# Altium project ISOLATED_CONTROLLER.PrjPcb
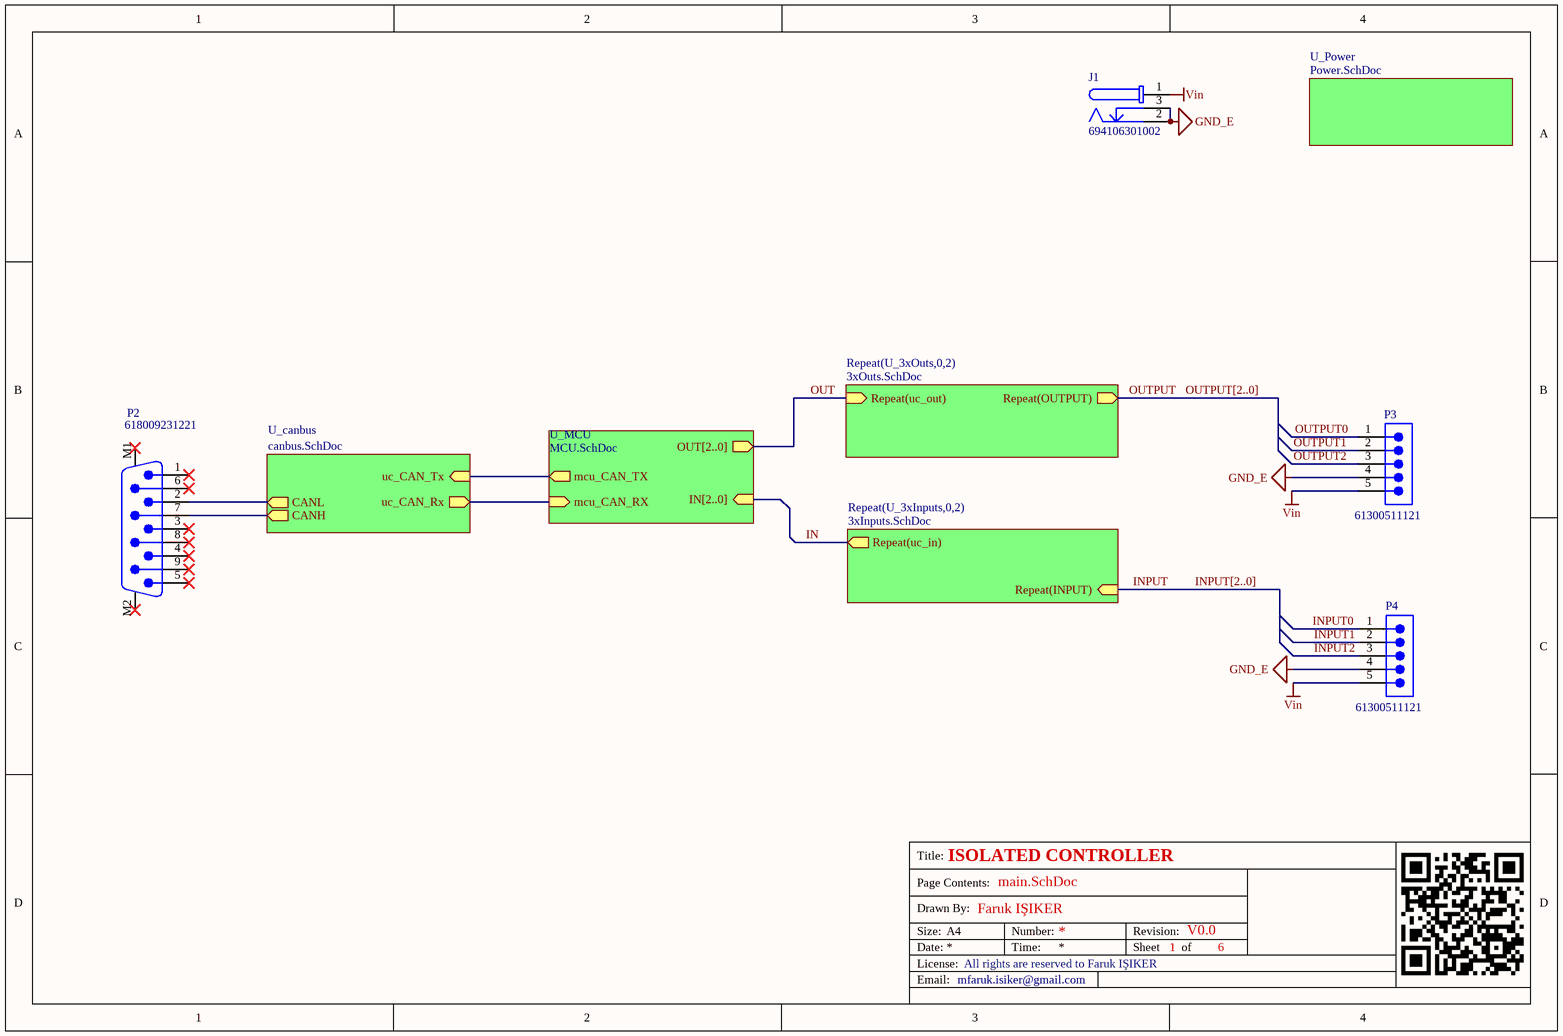
[diagram p0: main.SchDoc]
VersionRevision: V0.0; Project: ISOLATED CONTROLLER; License: All rights are reserved to Faruk IŞIKER; E-Mail: mfaruk.isiker@gmail.com; DrawnBy: Faruk IŞIKER
6 sheets, 88 parts. Net scope: hierarchical (ports join the sheet entries above them; power ports are global).
Board file: PCB1.PcbDoc
Sheets:
  main.SchDoc
    U_MCU = MCU.SchDoc
    U_Power = Power.SchDoc
    U_3xInputs0 = 3xInputs.SchDoc
    U_3xInputs1 = 3xInputs.SchDoc
    U_3xInputs2 = 3xInputs.SchDoc
    U_canbus = canbus.SchDoc
    U_3xOuts0 = 3xOuts.SchDoc
    U_3xOuts1 = 3xOuts.SchDoc
    U_3xOuts2 = 3xOuts.SchDoc

## Sheet main.SchDoc
size A4; SheetNumber: 1; SheetTotal: 6

### Parts
J1  694106301002  [694106301002]
P2  618009231221  [618009231221]
P3  61300511121  [61300511121]
P4  61300511121  [61300511121]

### Sub-sheets
Repeat(U_3xInputs,0,2) = 3xInputs.SchDoc: Repeat(uc_in) (out), Repeat(INPUT) (in)
Repeat(U_3xOuts,0,2) = 3xOuts.SchDoc: Repeat(OUTPUT) (out), Repeat(uc_out) (in)
U_canbus = canbus.SchDoc: uc_CAN_Tx (in), uc_CAN_Rx (out), CANH (out), CANL (out)
U_MCU = MCU.SchDoc: mcu_CAN_TX (out), mcu_CAN_RX (in), OUT[2..0] (out), IN[2..0] (in)
U_Power = Power.SchDoc: no entries

### Nets
GND_E: J1.2 J1.3 P3.4 P4.4
Vin: J1.1 P3.5 P4.5
IN: sheet Repeat(U_3xInputs,0,2)/Repeat(uc_in)
INPUT: sheet Repeat(U_3xInputs,0,2)/Repeat(INPUT)
INPUT0: P4.1  [project net INPUT]
INPUT1: P4.2  [project net INPUT]
INPUT2: P4.3  [project net INPUT]
OUT: sheet Repeat(U_3xOuts,0,2)/Repeat(uc_out)
OUTPUT: sheet Repeat(U_3xOuts,0,2)/Repeat(OUTPUT)
OUTPUT0: P3.1  [project net OUTPUT]
OUTPUT1: P3.2  [project net OUTPUT]
OUTPUT2: P3.3  [project net OUTPUT]
uc_CAN_Rx: sheet U_MCU/mcu_CAN_RX, sheet U_canbus/uc_CAN_Rx
uc_CAN_Tx: sheet U_MCU/mcu_CAN_TX, sheet U_canbus/uc_CAN_Tx
NetD5_1: P2.7 ; sheet U_canbus/CANH
NetD5_2: P2.2 ; sheet U_canbus/CANL

Not connected (* = marked no-connect by the designer): P2 1* 3* 4* 5* 6* 8* 9* M1* M2*

### Buses and harness runs
bus INPUT[2..0]
bus OUTPUT[2..0]

### Notes on the sheet
- Title:
- Drawn By:
- Page Contents:
- Size:
- Date:
- License:
- Email:
- A4
- Number:
- Time:
- Revision:
- Sheet
- of

### Library data of the parts
J1 = CMP-1502-00188-2: NexarPartId: 52676100; Voltage Rating (DC): 20V; Gender: Male; Voltage Rating: 24V; Connector Type: Power; Insulation Resistance: 100MΩ; Current Rating: 5A; Shielding: Unshielded; Number of Contacts: 3; Color: Black; Housing Material: Polyamide; Contact Gender: Female; REACH SVHC: Unknown; Termination: Through Hole; Height: 11mm; RoHS: Compliant; Mount: Through Hole; Flammability Rating: UL94 V-0; Packaging: Bulk; Min Operating Temperature: -40°C; Contact Plating: Tin; Max Operating Temperature: 85°C; Operating Supply Voltage: 24V; Contact Material: Gold, Tin
P2 = CMP-1502-00284-2: NexarPartId: 22865742; Pitch: 2.77mm; Number of Contacts: 9; Operating Supply Voltage: 125V; Insulation Resistance: 5GΩ; Gender: Male; Contact Resistance: 30mΩ; Current Rating: 3A; Mount: Through Hole; Housing Material: Steel; Contact Plating: Gold; Width: 12.5mm; Insulation Material: PBT; RoHS: Compliant; Depth: 18.5mm; Contact Material: Gold; Max Operating Temperature: 105°C; Min Operating Temperature: -55°C; Termination: SMD/SMT; Height: 12.7mm; Voltage Rating: 125V; Length: 30.8mm; Orientation: Right Angle; Number of Rows: 2; Number of Pins: 9; REACH SVHC: Unknown
P3 P4 = CMP-1502-01068-3: NexarPartId: 32855526; Connector Type: Male Pin; Gender: Male; Contact Resistance: 20mΩ; Pitch: 2.54mm; Operating Supply Voltage: 250V; Current Rating: 3A; Number of Contacts: 5; Lead Free: Lead Free; Color: Black; Packaging: Bulk; Lead Pitch: 2.54mm; Contact Material: Copper; Min Operating Temperature: -40°C; Contact Mating Length: 5.9944mm; Voltage Rating: 250V; Number of Pins: 5; Number of Positions: 5; Height: 8.89mm; Orientation: Vertical; REACH SVHC: Unknown; RoHS: Compliant; Contact Plating: Gold; Max Operating Temperature: 105°C; Mount: Through Hole; Number of Rows: 1; Termination: Solder

## Sheet MCU.SchDoc
size A4; SheetNumber: 3; SheetTotal: 6
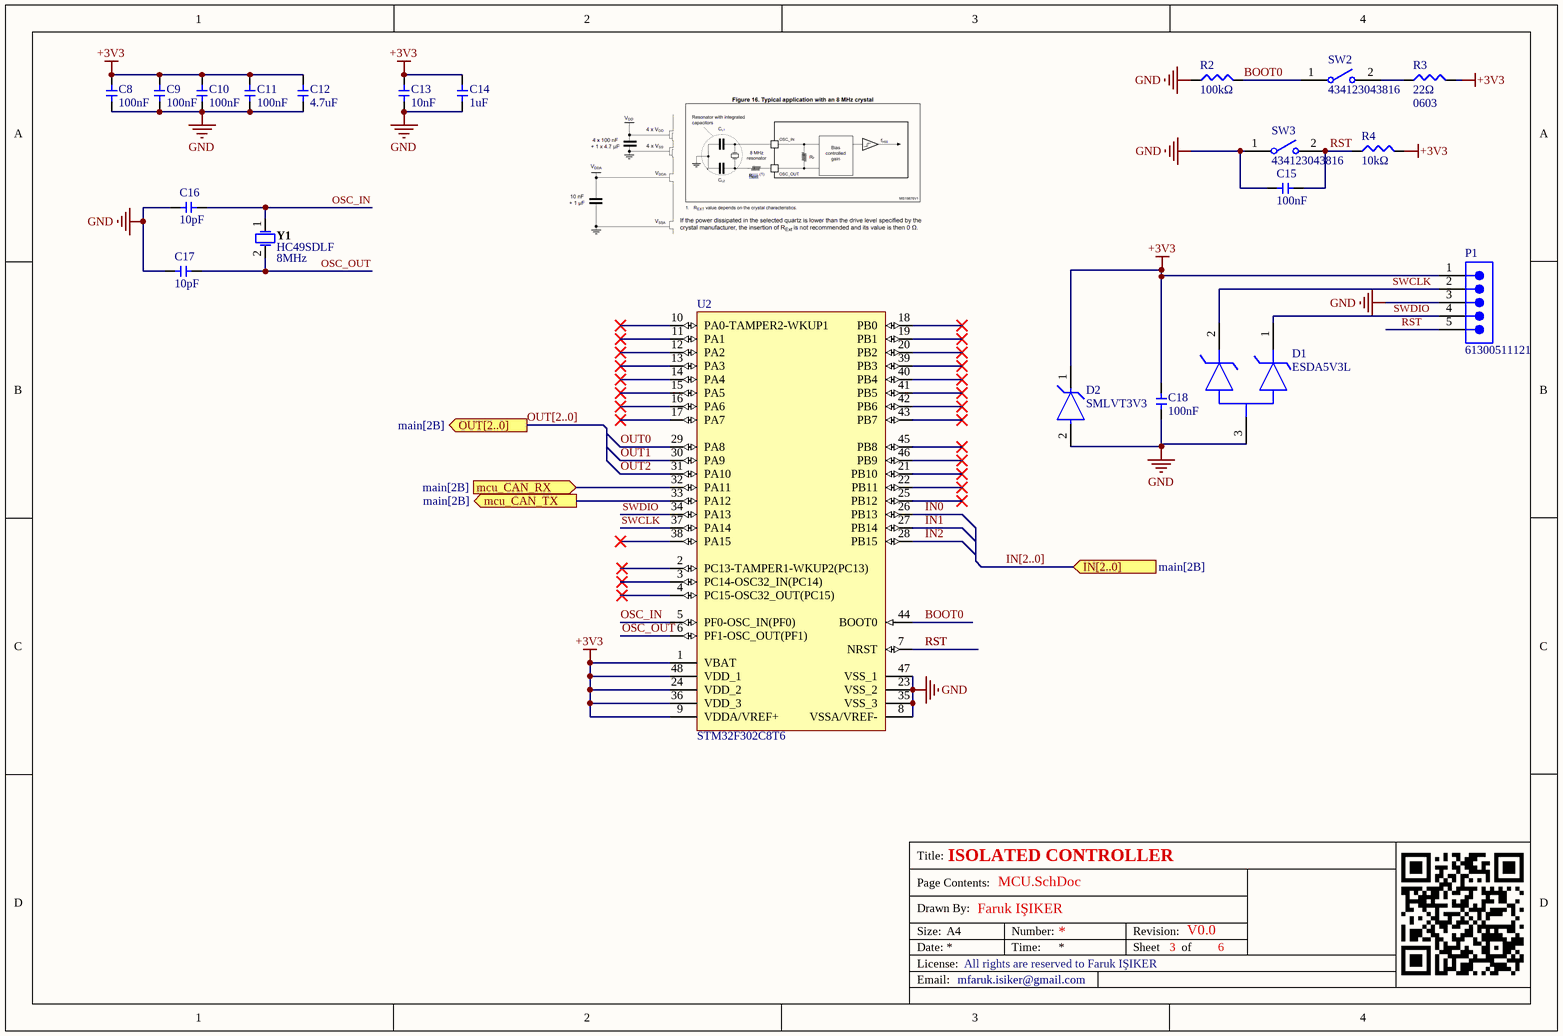
[diagram p1: MCU.SchDoc]

### Parts
C8  value 100nF  [0603_cap]  (hidden comment: 0603_100nF)
C9  value 100nF  [0603_cap]  (hidden comment: 0603_100nF)
C10  value 100nF  [0603_cap]  (hidden comment: 0603_100nF)
C11  value 100nF  [0603_cap]  (hidden comment: 0603_100nF)
C12  value 4.7uF  [0603_cap]  (hidden comment: 0603_4.7uF)
C13  value 10nF  [0603_cap]  (hidden comment: 0603_10nF)
C14  value 1uF  [0603_cap]  (hidden comment: 0603_1uF)
C15  value 100nF  [0603_cap]  (hidden comment: 0603_100nF)
C16  value 10pF  [0603_cap]  (hidden comment: 0603_10pF)
C17  value 10pF  [0603_cap]  (hidden comment: 0603_10pF)
C18  value 100nF  [0603_cap]  (hidden comment: 0603_100nF)
D1  ESDA5V3L  [FP-SOT23-3L-0053390-MFG]
D2  SMLVT3V3  [FP-SMB-MFG]
P1  61300511121  [61300511121]
R2  value 100kΩ  [0603-smd]  (hidden comment: 0603_100K)
R3  value 22Ω  Package: 0603  [0603-smd]  (hidden comment: 0603_22R)
R4  value 10kΩ  [0603-smd]  (hidden comment: 0603_10K)
SW2  434123043816  [WS-TASV_L6W3.5H4.3_4341x30438x6]
SW3  434123043816  [WS-TASV_L6W3.5H4.3_4341x30438x6]
U2  STM32F302C8T6  [STM-LQFP48_L]
Y1  Package Reference: HC49SDLF  Frequency: 8MHz  [FOX-HC49SDLF_V]  (hidden comment: FOXSDLF/080-20)

### Ports
IN[2..0] (in, see main[2B]), mcu_CAN_RX (in, see main[2B]), mcu_CAN_TX (out, see main[2B]), OUT[2..0] (out, see main[2B])

### Nets
+3V3: C8.2 C9.2 C10.2 C11.2 C12.2 C13.2 C14.2 C18.2 D2.1(K) P1.1 R3.2 R4.1 U2.1(VBAT) U2.9(VDDA/VREF+) U2.24(VDD_2) U2.36(VDD_3) U2.48(VDD_1)
GND: C8.1 C9.1 C10.1 C11.1 C12.1 C13.1 C14.1 C15.1 C16.1 C17.1 C18.1 D1.3(COMMON_ANODE) D2.2(A) P1.3 R2.2 SW3.1 U2.8(VSSA/VREF-) U2.23(VSS_2) U2.35(VSS_3) U2.47(VSS_1)
BOOT0: R2.1 SW2.1 U2.44(BOOT0)
IN0: U2.26(PB13)
IN1: U2.27(PB14)
IN2: U2.28(PB15)
OSC_IN: C16.2 U2.5(PF0-OSC_IN(PF0)) Y1.1
OSC_OUT: C17.2 U2.6(PF1-OSC_OUT(PF1)) Y1.2
OUT0: U2.29(PA8)
OUT1: U2.30(PA9)
OUT2: U2.31(PA10)
RST: C15.2 P1.5 R4.2 SW3.2 U2.7(NRST)
SWCLK: D1.2(2_CATHODE) P1.2 U2.37(PA14)
SWDIO: D1.1(1_CATHODE) P1.4 U2.34(PA13)
uc_CAN_Rx: U2.32(PA11) ; port mcu_CAN_RX
uc_CAN_Tx: U2.33(PA12) ; port mcu_CAN_TX
NetR3_1: R3.1 SW2.2

Not connected (* = marked no-connect by the designer): U2 2(PC13-TAMPER1-WKUP2(PC13))* 3(PC14-OSC32_IN(PC14))* 4(PC15-OSC32_OUT(PC15))* 10(PA0-TAMPER2-WKUP1)* 11(PA1)* 12(PA2)* 13(PA3)* 14(PA4)* 15(PA5)* 16(PA6)* 17(PA7)* 18(PB0)* 19(PB1)* 20(PB2)* 21(PB10)* 22(PB11)* 25(PB12)* 38(PA15)* 39(PB3)* 40(PB4)* 41(PB5)* 42(PB6)* 43(PB7)* 45(PB8)* 46(PB9)*

### Buses and harness runs
bus IN[2..0] = port IN[2..0]
bus OUT[2..0] = port OUT[2..0]

### Notes on the sheet
- Title:
- Drawn By:
- Page Contents:
- Size:
- Date:
- License:
- Email:
- A4
- Number:
- Time:
- Revision:
- Sheet
- of

### Library data of the parts
C8-C11 C15 C18 = 0603_100nF: Volt: V; Package: 0603
C12 = 0603_4.7uF: Volt: 25V; Package: 0603
C13 = 0603_10nF: Volt: V; Package: 0603
C14 = 0603_1uF: Volt: V; Package: 0603
C16 C17 = 0603_10pF: Volt: V; Package: 0603
D1 = CMP-12225-000053-1: TVS DIODE 3V SOT23-3; Manufacturer: STMicroelectronics; Capacitance: 220pF; Peak Pulse Power: 300W; Value: 220pF; Max Junction Temp: +150°C; Standoff Height: 0mm; Peak Pulse Current: 25A; Direction: Unidirectional; Number Of Channels: 2; Breakdown Voltage: 5.3V; Mouser Description: ESDA Series 2 Channel 5.3 V 220 pF SMT Uni-Directional Transil? Array - SOT-23; Device Class L2: TVS Diodes; Ipc Land Pattern Name: SOT95P255X115-3; Manufacturer Part Number: ESDA5V3L; Temperature Range Low: -40°C; Device Class L3: unset; Height: 1.4mm; Lead Free: Yes; ComponentLink2URL: https://www.st.com/content/ccc/resource/technical/document/datasheet/eb/9f/a7/ac/7b/b6/46/7f/CD00002057.pdf/files/CD00002057.pdf/jcr:content/translations/en.CD00002057.pdf; Category: Diode; Temperature: -40°C to +150°C; Automotive: No; Package: SOT23-3L-0053390; Digikey Description: TVS DIODE 3V SOT23-3; Reverse Standoff Voltage: 3V; Octopart: https://octopart.com/esda5v3l-stmicroelectronics-347708; Device Class L1: Circuit Protection; Temperature Range High: +150°C; RoHS: TRUE; ComponentLink2Description: Datasheet
D2 = CMP-2000-07127-2: TVS DIODE 3.3V 10.3V SMB; Manufacturer: STMicroelectronics; Standoff Height: 0.05mm; Max Junction Temp: +175°C; Capacitance: 5200pF; Breakdown Voltage: 4.1V; Peak Pulse Power: 600W; Clamping Voltage: 7.3V; Direction: Unidirectional; Number Of Channels: 1; Peak Pulse Current: 50A; Value: 5200pF; ComponentLink2Description: Datasheet; Digikey Description: TVS DIODE 3.3V 10.3V SMB; Automotive: No; Temperature Range Low: -55°C; Device Class L2: TVS Diodes; RoHS: TRUE; ComponentLink2URL: https://www.st.com/resource/en/datasheet/smlvt3v3.pdf; Temperature: -55°C to +175°C; Device Class L3: unset; Package: SMB; Lead Free: Yes; Mouser Description: TVS Diodes - Transient Voltage Suppressors 600W 3.3V Unidirect; Height: 2.65mm; Octopart: https://octopart.com/smlvt3v3-stmicroelectronics-347049; Temperature Range High: +175°C; Category: Diode; Manufacturer Part Number: SMLVT3V3; Device Class L1: Circuit Protection
P1 = CMP-1502-01068-3: as P3 on sheet main; Lead Free: Lead Free; Color: Black; Packaging: Bulk; Lead Pitch: 2.54mm; Contact Material: Copper; Min Operating Temperature: -40°C; Contact Mating Length: 5.9944mm; Voltage Rating: 250V; Number of Pins: 5; Number of Positions: 5; Height: 8.89mm; Orientation: Vertical; REACH SVHC: Unknown; RoHS: Compliant; Contact Plating: Gold; Max Operating Temperature: 105°C; Mount: Through Hole; Number of Rows: 1; Termination: Solder
R2 = 0603_100K: Power: W; Package: 0603
R3 = 0603_22R: Power: W
R4 = 0603_10K: Power: W; Package: 0603
SW2 SW3 = CMP-1460-00005-2: NexarPartId: 22866049; Current Rating: 50mA; Voltage Rating: 12V; Insulation Resistance: 100MΩ; Packaging: Tape and Reel; Min Operating Temperature: -40°C; Contact Current Rating: 50mA; RoHS: Compliant; Height: 4.3mm; Contact Plating: Silver; Color: Black; Width: 6mm; Contact Resistance: 100mΩ; Max Operating Temperature: 85°C
U2 = CMP-0537-00011-1: ARM Cortex-M4 32-bit MCU, 64 KB Flash, 16 KB Internal RAM, 37 I/Os, 48-Pin LQFP, -40 to 85 degC, Tray; Operating Frequency(F) (Processor speed) (MHz): 72; Internal RAM Size (kB): 16; D/A Converter: 1; FLASH Size (Prog) (kB): 64; I/Os (High Current): 37; Supply Voltage(Vcc) min (V): 2; ComponentLink2Description: Datasheet; Package Reference: LQFP48; Package Description: 48-Pin Low Profile Quad Flat Package, Body 7 x 7 mm, Pitch 0.5 mm; Packing: Tray; ComponentLink1URL: http://www.st.com/; ComponentLink1Description: Manufacturer URL; DatasheetVersion: Rev. 5; Core: ARM Cortex-M4; Mounting Technology: Surface Mount; ComponentLink2URL: http://www.st.com/st-web-ui/static/active/en/resource/technical/document/datasheet/DM00093333.pdf
Y1 = CMP-2100-03639-1: Resistance Weld Crystal, 8 MHz, +/- 30 ppm, -20 to 70 degC, 2-Pin SMD, RoHS, Tape and Reel; Manufacturer: FOX Electronics; Series Resistance: 80Ohm; Load Capacitance: 20pF; Tolerance: 50ppm; Frequency Tolerance: 30ppm; Datasheet URL: http://www.foxonline.com/pdfs/hc49sdlf.pdf; Height: 4.5mm; Mount: SurfaceMount; Packaging: TapeandReel; Length: 11.7mm; Termination: SMD/SMT; Number of Pins: 2; Depth: 5mm; Min Operating Temperature: -20degC; Package Quantity: 1000; RoHSCompliant: True; Lead Free: LeadFree; Width: 5mm; Case/Package: SMD/SMT; Manufacturer URL: http://www.foxonline.com/; Max Operating Temperature: 70degC; REACH SVHC: NoSVHC; Datasheet Version: 42064.0; Package Description: 2-Pin Surface Mount Device, Body 5 x 11.7 mm; Frequency Stability: 50ppm; ESR (Equivalent Series Resistance): 80Ohm; Radiation Hardening: No

## Sheet Power.SchDoc
size A4; SheetNumber: 2; SheetTotal: 6
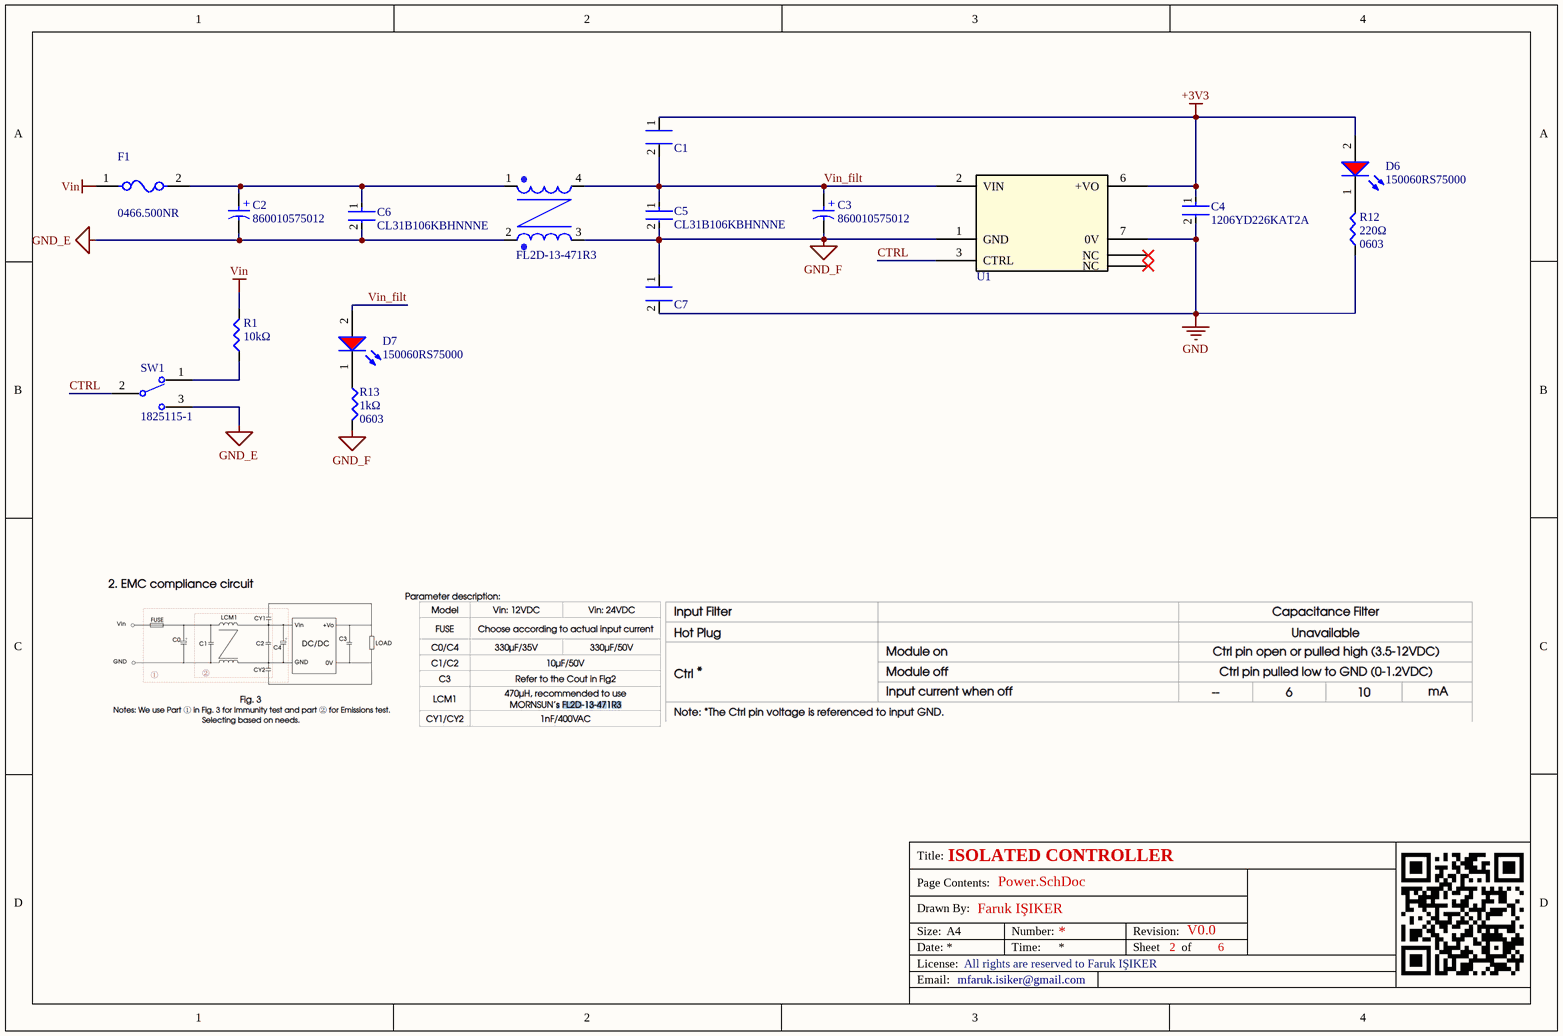
[diagram p2: Power.SchDoc]

### Parts
C1  1nf 400V AC 7.5mm Lead  [PCBComponent_1]  (value not drawn)
C2  860010575012  [WCAP-ATG8_D10H12.5]
C3  860010575012  [WCAP-ATG8_D10H12.5]
C4  1206YD226KAT2A  [FP-1206-L_3_2_0_2-W_1_6_0-IPC_A]
C5  CL31B106KBHNNNE  [FP-CL31B106KBHNNNE-IPC_A]
C6  CL31B106KBHNNNE  [FP-CL31B106KBHNNNE-IPC_A]
C7  1nf 400V AC 7.5mm Lead  [PCBComponent_1]  (value not drawn)
D6  150060RS75000  [WL-SMCW_0603_150060xx75000]
D7  150060RS75000  [WL-SMCW_0603_150060xx75000]
F1  0466.500NR  [FP-0466-MFG]
FL2D-13-471R3  EMC Filte  [FL2D-13-471R3]  (value not drawn)
R1  value 10kΩ  [0603-smd]  (hidden comment: 0603_10K)
R12  value 220Ω  Package: 0603  [0603-smd]  (hidden comment: 0603_220R)
R13  value 1kΩ  Package: 0603  [0603-smd]  (hidden comment: 0603_1K)
SW1  1825115-1  [FP-1825115-1-MFG]
U1  DC DC CONVERTER 3.3V 6W  [VRB_S-6WR3_MNS]  (value not drawn)

### Nets
+3V3: C1.1 C4.1 D6.2(A) U1.6(+VO)
GND: C4.2 C7.2 R12.1 U1.7(0V)
GND_E: C2.2(N) C6.2 FL2D-13-471R3.2 SW1.3
GND_F: C3.2(N) C5.2 C7.1 FL2D-13-471R3.3 R13.2 U1.1(GND)
Vin: F1.1 R1.2
CTRL: SW1.2 U1.3(CTRL)
Vin_filt: C1.2 C3.1(P) C5.1 D7.2(A) FL2D-13-471R3.4 U1.2(VIN)
NetC2_1: C2.1(P) C6.1 F1.2 FL2D-13-471R3.1
NetD6_1: D6.1(K) R12.2
NetD7_1: D7.1(K) R13.1
NetR1_1: R1.1 SW1.1

Not connected (* = marked no-connect by the designer): U1 5(NC)* 8(NC)*

### Notes on the sheet
- Title:
- Drawn By:
- Page Contents:
- Size:
- Date:
- License:
- Email:
- A4
- Number:
- Time:
- Revision:
- Sheet
- of
- (in symbol CMP-03913-54007241-1) +

### Library data of the parts
C1 C7 = C717U102MYVDBA7317: Suppression Cap, 1000Pf, Class X1/ Y2 Rohs Compliant: Yes |Kemet C717U102MYVDBA7317; Manufacturer: KEMET; Supplier 1: Mouser; Manufacturer Part Number: C717U102MYVDBA7317; RoHS: Yes; Category: Ceramic Capacitors; Stock 1: 1838; Pricing 1: 1=0,72, 10=0,387, 50=0,387, 100=0,25, 1000=0,223, 10000=0,18 (USD); RoHS Compliant: Yes; Supplier Part Number 1: 80-C717U102MYVDB7317; ComponentLink1Description: Datasheet; ComponentLink1URL: https://content.kemet.com/datasheets/KEM_C1103_KJY.pdf
C2 C3 = CMP-03913-54007241-1: 860010575012 WCAP-ATG8 Aluminum Electrolytic Capacitors; Ripple Current: 528mA; Voltage Rating: 35V; Capacitance: 330µF; Pitch: 5mm; Tolerance: 20%; Leakage Current: 115.5µA; Life (Hours): 2000hours; Case/Package: Radial; Max Operating Temperature: 85°C; REACH SVHC: Unknown; Min Operating Temperature: -40°C; NexarPartId: 54007241; Lead Pitch: 5mm; RoHS: Non-Compliant; Voltage Rating (DC): 35V; Diameter: 10mm; Height: 12.5mm; Length: 12.5mm
C4 = CMP-1037-04992-2: General Purpose Ceramic Capacitor, 1206, 22uF, 10%, X5R, 15%, 16V; REACH SVHC: No SVHC; Height: 0.07mm; Lead Free: Lead Free; Voltage Rating: 16V; Width: 0.063inch; Voltage Rating (DC): 16V; Mount: Surface Mount; Capacitance: 22uF; Case Code (Imperial): 1206; Package Quantity: 1; Radiation Hardening: No; Packaging: Tape and Reel; Number of Pins: 2; Construction: Flat; Max Operating Temperature: 85°C; Depth: 1.6mm; Case Code (Metric): 3216; Thickness: 0.07inch; Min Operating Temperature: -55°C; Contact Plating: Tin; Dielectric: X5R; Case/Package: 1206; Series: -; Termination: SMD/SMT; Length: 3.2mm; RoHS Compliant: Yes; Tolerance: 10%
C5 C6 = CMP-2000-07530-2: CAP CER 10UF 50V X7R 1206; Manufacturer: Samsung; Tolerance: 10%; Material: Ceramic; Temperature Coefficient: 15%; Temperature Characteristic: X7R; Digikey Description: CAP CER 10UF 50V X7R 1206; Device Class L1: Passive Components; Value: 10uF; Lead Free: Yes; Device Class L3: Ceramic Capacitors; Octopart: https://octopart.com/cl31b106kbhnnne-samsung-30507377; ComponentLink2URL: http://www.samsungsem.com/global/front/downloadcms.do?path=%2F%2Fglobal%2F%2Fsupport%2F%2Fproduct-search%2F%2Fmlcc%2F%2F__icsFiles%2F%2Fafieldfile%2F%2F2019%2F%2F06%2F%2F18&fileName=CL31B106KBHNNNE-19.pdf; Voltage Rating: 50V; Temperature Range Low: -55°C; RoHS: TRUE; Temperature: -55°C to +125°C; Category: Cap; ComponentLink2Description: Datasheet; Manufacturer Part Number: CL31B106KBHNNNE; Automotive: No; Device Class L2: Capacitors; Capacitance: 10uF; Height: 1.8mm; Temperature Range High: +125°C; Package: CL31B106KBHNNNE
D6 D7 = CMP-1426-00001-3: NexarPartId: 29717776; Color: Red; Power Dissipation: 72mW; Max Reverse Voltage (DC): 5V; Peak Wavelength: 630nm; Viewing Angle: 140°; Forward Voltage: 2V; Luminous Intensity: 250mcd; Forward Current: 100mA; Dominant Wavelength: 625nm; Lens Style: Clear, Rectangular; Max Junction Temperature (Tj): 95°C; Test Current: 20mA; Mount: Surface Mount; Packaging: Tape and Reel; Case Code (Metric): 1608; Max Operating Temperature: 85°C; Case Code (Imperial): 0603; REACH SVHC: Unknown; Width: 800µm; Length: 1.6mm; Reverse Voltage: 5V; Height: 700µm; Case/Package: 0603; RoHS: Compliant; Wavelength: 625nm; Min Operating Temperature: -40°C
F1 = CMP-08605-000018-1: FUSE BOARD MOUNT 500MA 63VAC/VDC; Manufacturer: Littelfuse Inc; Fuse Voltage Drop: 158.47mV; Voltage Rating: 63V; Fuse Interrupt Dc Current: 50A; Fuse Blow Speed: Fast; Fuse I2T: 0.006A2Sec; Resistance: 0.248Ω; Value: 0.248Ω; Fuse Current: 0.5A; Manufacturer Part Number: 0466.500NR; Digikey Description: FUSE BOARD MOUNT 500MA 63VAC/VDC; Device Class L2: Fuses; Max Fuse Dc Voltage: 63V; Mouser Description: SMD Fuse 0.5 A Fast-Blow, 466 1206; Octopart: https://octopart.com/0466.500nr-littelfuse-566004; Temperature Range High: +90°C; Lead Free: Yes; Fuse Interrupt Ac Current: 50A; RoHS: TRUE; Device Class L1: Circuit Protection; Height: 0.66mm; Automotive: No; Category: Fuse; Temperature: -55°C to +90°C; Package: 0466; Device Class L3: unset; ComponentLink2URL: https://www.littelfuse.com/~/media/electronics/datasheets/fuses/littelfuse_fuse_466_datasheet.pdf.pdf; Max Fuse Ac Voltage: 63V; ComponentLink2Description: Datasheet; Temperature Range Low: -55°C
FL2D-13-471R3 = FL2D-13-471R3: ComponentLink1Description: Datasheet; ComponentLink1URL: https://www.mornsun-power.com/html/pdf/FL2D-13-471R3.html
R1 = 0603_10K: Power: W; Package: 0603
R12 = 0603_220R: Power: W
R13 = 0603_1K: Power: W
SW1 = CMP-03405-000003-1: SWITCH SLIDE SPDT 250MA 125V; Manufacturer: TE Connectivity; Operating Force: 250gf; Electromechanical Life: 6000Cycles; Contact Resistance: 30mΩ; Voltage Rating Dc: 12V; Temperature Range High: +85°C; Manufacturer Part Number: 1825115-1; Temperature: -10°C to +85°C; Package: 1825115-1; Voltage Rating Ac: 125V; Category: Switch; Digikey Description: SWITCH SLIDE SPDT 250MA 125V; Throw Configuration: SPDT; RoHS: TRUE; Mount: Through Hole; Device Class L2: Switches; ComponentLink2Description: Datasheet; Automotive: No; ComponentLink2URL: https://www.te.com/usa-en/product-1825115-1.html?te_bu=Cor&te_type=other&te_campaign=oct_glo_cor-oct-global-oth-prtnr-fy19-oct-octo-buy-bom_sma-298_2&elqCampaignId=35216; Contact Current Rating: 250mA; Temperature Range Low: -10°C; Device Class L3: Slide Switches; Device Class L1: Electromechanical; Octopart: https://octopart.com/sls121pc04-te+connectivity-39426454; Lead Free: Yes
U1 = VRB1203S-6WR3: Isolated Module DC DC Converter 1 Output 3.3V 1.35A 9V - 18V Input; Mfr_Name: MORNSUN; Type: DC DC Converters; RefDes: RefDes; ComponentLink1Description: Datasheet; ComponentLink1URL: https://www.mornsun-power.com/html/pdf/VRB1203S-6WR3.html

## Sheet 3xInputs.SchDoc
size A4; SheetNumber: 4; SheetTotal: 6
Used 3 times, as channels U_3xInputs0, U_3xInputs1, U_3xInputs2. Parts and nets are listed once, with the designators drawn on the sheet.
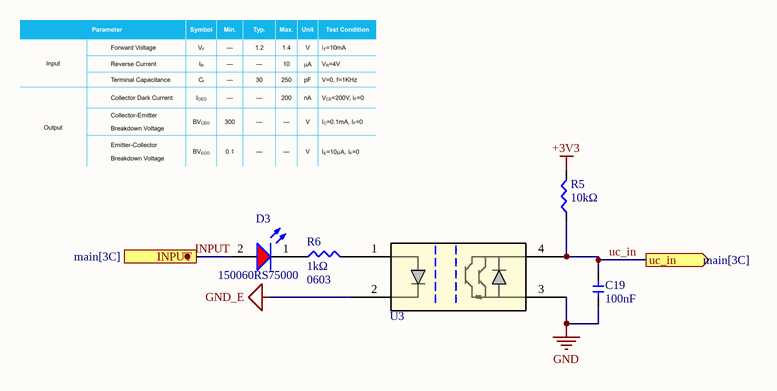
[diagram p3: 3xInputs.SchDoc]

### Parts
C19  value 100nF  [0603_cap]  (hidden comment: 0603_100nF)
D3  150060RS75000  [WL-SMCW_0603_150060xx75000]
R5  value 10kΩ  [0603-smd]  (hidden comment: 0603_10K)
R6  value 1kΩ  Package: 0603  [0603-smd]  (hidden comment: 0603_1K)
U3  LTV-352T  [IC4_LTV-352T_LTO-M]  (value not drawn)

### Ports
INPUT (in, see main[3C]), uc_in (out, see main[3C])

### Nets
+3V3: R5.2
GND: C19.1 U3.3
GND_E: U3.2
INPUT: D3.2(A) ; port INPUT
uc_in: C19.2 R5.1 U3.4 ; port uc_in
NetD3_1: D3.1(K) R6.1
NetR6_2: R6.2 U3.1

### Channels
U_3xInputs0: designators end in A; ports INPUT=INPUT uc_in=IN0
U_3xInputs1: designators end in B; ports INPUT=INPUT uc_in=IN1
U_3xInputs2: designators end in C; ports INPUT=INPUT uc_in=IN2

### Notes on the sheet
- Title:
- Drawn By:
- Page Contents:
- Size:
- Date:
- License:
- Email:
- A4
- Number:
- Time:
- Revision:
- Sheet
- of

### Library data of the parts
C19 = 0603_100nF: Volt: V; Package: 0603
D3 = CMP-1426-00001-3: as D6 on sheet Power; Mount: Surface Mount; Packaging: Tape and Reel; Case Code (Metric): 1608; Max Operating Temperature: 85°C; Case Code (Imperial): 0603; REACH SVHC: Unknown; Width: 800µm; Length: 1.6mm; Reverse Voltage: 5V; Height: 700µm; Case/Package: 0603; RoHS: Compliant; Wavelength: 625nm; Min Operating Temperature: -40°C
R5 = 0603_10K: Power: W; Package: 0603
R6 = 0603_1K: Power: W
U3 = LTV-352T: LTV Series Single Channel 300V 3750 Vrms Transistor Output Optocoupler SMT DIP-4; Mfr_Name: LITE-ON; Manufacturer: Vishay Lite-On; RefDes: RefDes; Type: Type; Supplier 1: Rs; Manufacturer Part Number: LTV-352T; RoHS: Yes; Category: Optocouplers; Stock 1: 22730; Pricing 1: 25=0,29, 50=0,278, 250=0,228, 500=0,2 (GBP); ComponentLink1URL: https://datasheet.ciiva.com/11772/0900766b80de6aef-11772096.pdf?src-supplier=Rs; ComponentLink1Description: https://datasheet.ciiva.com/11772/0900766b80de6aef-11772096.pdf?src-supplier=Rs; ComponentLink2URL: https://datasheet.ciiva.com/2086/ltv-352t-2086258.pdf?src-supplier=Digikey; ComponentLink2Description: https://datasheet.ciiva.com/2086/ltv-352t-2086258.pdf?src-supplier=Digikey; ComponentLink3URL: https://datasheet.ciiva.com/19471/1260710-19471302.pdf?src-supplier=Jameco; ComponentLink3Description: https://datasheet.ciiva.com/19471/1260710-19471302.pdf?src-supplier=Jameco; ComponentLink4URL: https://datasheet.ciiva.com/15118/getdatasheetpartid-145582-15118811.pdf?src-supplier=Verical; ComponentLink4Description: https://datasheet.ciiva.com/15118/getdatasheetpartid-145582-15118811.pdf?src-supplier=Verical; ComponentLink5URL: https://datasheet.ciiva.com/2086/s-110-ltv-352t20140520-2086259.pdf?src-supplier=Digikey; ComponentLink5Description: https://datasheet.ciiva.com/2086/s-110-ltv-352t20140520-2086259.pdf?src-supplier=Digikey; ComponentLink6URL: https://datasheet.ciiva.com/2086/s-110-ltv-352t20140520-2086260.pdf?src-supplier=Digikey; ComponentLink6Description: https://datasheet.ciiva.com/2086/s-110-ltv-352t20140520-2086260.pdf?src-supplier=Digikey; Supplier Part Number 1: 6912063P

## Sheet canbus.SchDoc
size A4; SheetNumber: 6; SheetTotal: 6
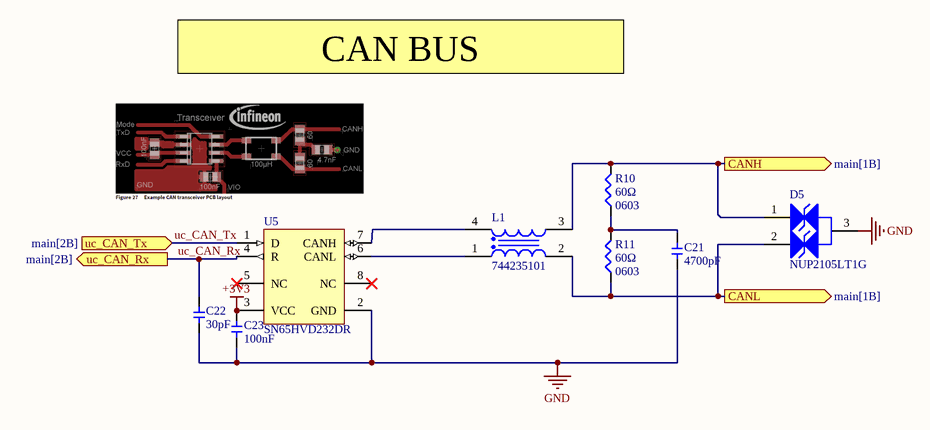
[diagram p4: canbus.SchDoc]

### Parts
C21  value 4700pF  [0603_cap]  (hidden comment: 0603_4700pF)
C22  value 30pF  [0603_cap]  (hidden comment: 0603_30pF)
C23  value 100nF  [0603_cap]  (hidden comment: 0603_100nF)
D5  NUP2105LT1G  [ONSC-SOT-23-3-318-08_V]
L1  744235101  [WE-CNSW_1812]
R10  value 60Ω  Package: 0603  [0603-smd]  (hidden comment: 0603_60R)
R11  value 60Ω  Package: 0603  [0603-smd]  (hidden comment: 0603_60R)
U5  SN65HVD232DR  [D0008A_M]

### Ports
CANH (out, see main[1B]), CANL (out, see main[1B]), uc_CAN_Rx (out, see main[2B]), uc_CAN_Tx (in, see main[2B])

### Nets
+3V3: C23.2 U5.3(VCC)
GND: C21.1 C22.1 C23.1 D5.3(K) U5.2(GND)
uc_CAN_Rx: C22.2 U5.4(R) ; port uc_CAN_Rx
uc_CAN_Tx: U5.1(D) ; port uc_CAN_Tx
NetC21_2: C21.2 R10.1 R11.2
NetD5_1: D5.1(K) L1.3 R10.2 ; port CANH
NetD5_2: D5.2(K) L1.2 R11.1 ; port CANL
NetL1_1: L1.1 U5.6(CANL)
NetL1_4: L1.4 U5.7(CANH)

Not connected (* = marked no-connect by the designer): U5 5(NC)* 8(NC)*

### Notes on the sheet
- CAN BUS
- Title:
- Drawn By:
- Page Contents:
- Size:
- Date:
- License:
- Email:
- A4
- Number:
- Time:
- Revision:
- Sheet
- of

### Library data of the parts
C21 = 0603_4700pF: Volt: V; Package: 0603
C22 = 0603_30pF: Volt: V; Package: 0603
C23 = 0603_100nF: Volt: V; Package: 0603
D5 = CMP-1063-00164-1: Dual Line CAN Bus Protector, 3-Pin SOT-23, Pb-Free, Tape and Reel; Manufacturer: On Semiconductor; IR Max (uA): 0.1; Number of Lines: 2; Direction: Bidirectional; C Max (pF): 30; PPK Max (W): 350; V(BR) Min (V): 26.2; ComponentLink3URL: http://www.onsemi.cn/pub_link/Collateral/318-08.PDF; Mounting Technology: Surface Mount; ComponentLink2Description: Datasheet; PartNumber: NUP2105LT1G; ComponentLink1URL: http://www.onsemi.com/; PackageVersion: Rev. AP, 11/2009; DatasheetVersion: Rev. 5; RoHS: Pb-Free; PackageReference: SOT-23-3-318-08; ComponentLink2URL: http://www.onsemi.cn/pub_link/Collateral/NUP2105L-D.PDF; ComponentLink1Description: Manufacturer URL; PackageDescription: 3-Pin Small Outline Transistor, Body 2.92 x 1.3 mm, Pitch 0.95 mm; Packing: Tape and Reel; ComponentLink3Description: Package Specification
L1 = CMP-207849-000010-2: CMC 100UH 150MA 2LN 8 KOHM SMD; NexarPartId: 61645269; Inductance: 100µH; Number of Lines: 2; DC Resistance (DCR): 2Ω; Voltage Rating (DC): 60V; Test Frequency: 100kHz; Max Current Rating: 150mA; RoHS: Compliant; Packaging: Tape & Reel (TR); Ambient Temperature Range Low: -40°C; Number of Pins: 4; Ambient Temperature Range High: 85°C; Min Operating Temperature: -40°C; Height: 2.8mm; RMS Current (Irms): 150mA; Width: 3.2mm; Current Rating: 150mA; Mount: Surface Mount; Max Operating Temperature: 125°C; Composition: Wirewound; Length: 4.5mm; Series Resistance: 2Ω; Voltage Rating: 60V
R10 R11 = 0603_60R: Power: W
U5 = CMP-0315-00075-2: 3.3 V Can Transceiver, 17 mA, -40 to 85 degC, 8-pin SOIC (D), Green (RoHS & no Sb/Br); Manufacturer: Texas Instruments; Supply Voltage(s)(V): 3.3; Receivers Per Package: 1; ICC(Max)(mA): 17; Rating: Catalog; Transient Pulse Protection(V): -25 to 25; Mounting Technology: Surface Mount; PartNumber: SN65HVD232DR; Code_JEDEC: MS-012AA; Eco-Plan: Green (RoHS & no Sb/Br); Isolated: No; SubFamily: CAN; Footprint: SN65HVD232; Drivers Per Package: 1; ComponentLink1URL: http://www.ti.com/general/docs/lit/getliterature.tsp?genericPartNumber=SN65HVD232&fileType=pdf; ComponentLink1Description: Datasheet; PackageDescription: 8-Pin Plastic Small Outline Integrated Circuit, 4.9 x 3.9 mm, Pitch 1.27 mm Pitch; PackageReference: D0008A; DatasheetVersion: SLOS346K; PackageVersion: revM, Jun-2011

## Sheet 3xOuts.SchDoc
size A4; SheetNumber: 5; SheetTotal: 6
Used 3 times, as channels U_3xOuts0, U_3xOuts1, U_3xOuts2. Parts and nets are listed once, with the designators drawn on the sheet.
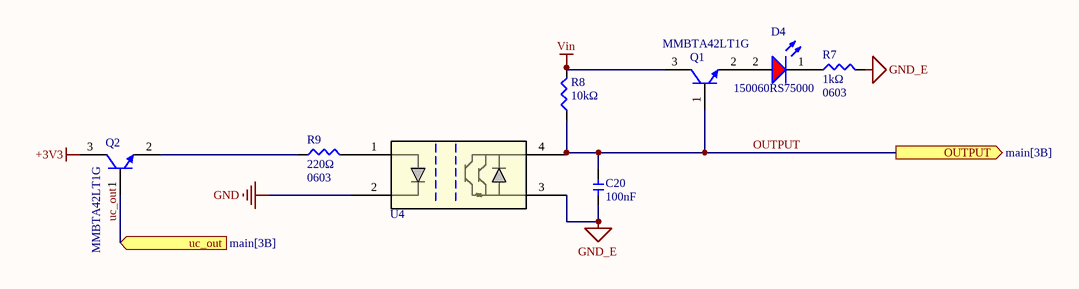
[diagram p5: 3xOuts.SchDoc]

### Parts
C20  value 100nF  [0603_cap]  (hidden comment: 0603_100nF)
D4  150060RS75000  [WL-SMCW_0603_150060xx75000]
Q1  MMBTA42LT1G  [ONSC-SOT-23-3-318-08_V]
Q2  MMBTA42LT1G  [ONSC-SOT-23-3-318-08_V]
R7  value 1kΩ  Package: 0603  [0603-smd]  (hidden comment: 0603_1K)
R8  value 10kΩ  [0603-smd]  (hidden comment: 0603_10K)
R9  value 220Ω  Package: 0603  [0603-smd]  (hidden comment: 0603_220R)
U4  LTV-352T  [IC4_LTV-352T_LTO-M]  (value not drawn)

### Ports
OUTPUT (out, see main[3B]), uc_out (in, see main[3B])

### Nets
+3V3: Q2.3(C)
GND: U4.2
GND_E: C20.1 R7.2 U4.3
Vin: Q1.3(C) R8.2
OUTPUT: C20.2 Q1.1(B) R8.1 U4.4 ; port OUTPUT
uc_out: Q2.1(B) ; port uc_out
NetD4_1: D4.1(K) R7.1
NetD4_2: D4.2(A) Q1.2(E)
NetQ2_2: Q2.2(E) R9.1
NetR9_2: R9.2 U4.1

### Channels
U_3xOuts0: designators end in A; ports OUTPUT=OUTPUT uc_out=OUT0
U_3xOuts1: designators end in B; ports OUTPUT=OUTPUT uc_out=OUT1
U_3xOuts2: designators end in C; ports OUTPUT=OUTPUT uc_out=OUT2

### Notes on the sheet
- Title:
- Drawn By:
- Page Contents:
- Size:
- Date:
- License:
- Email:
- A4
- Number:
- Time:
- Revision:
- Sheet
- of

### Library data of the parts
C20 = 0603_100nF: Volt: V; Package: 0603
D4 = CMP-1426-00001-3: as D6 on sheet Power; Mount: Surface Mount; Packaging: Tape and Reel; Case Code (Metric): 1608; Max Operating Temperature: 85°C; Case Code (Imperial): 0603; REACH SVHC: Unknown; Width: 800µm; Length: 1.6mm; Reverse Voltage: 5V; Height: 700µm; Case/Package: 0603; RoHS: Compliant; Wavelength: 625nm; Min Operating Temperature: -40°C
Q1 Q2 = CMP-1048-00662-1: High Voltage Transistor, NPN Silicon, 3-Pin SOT-23, Pb-Free, Tape and Reel; Manufacturer: On Semiconductor; fT Min (MHz): 50; IC Continuous (A): 0.5; ComponentLink1URL: http://www.onsemi.com/; ComponentLink3URL: http://www.onsemi.cn/pub_link/Collateral/318-08.PDF; RoHS: TRUE; ComponentLink2Description: Datasheet; PartNumber: MMBTA42LT1G; Polarity: NPN; DatasheetVersion: Rev. 12; PackageReference: SOT-23-3-318-08; PackageDescription: 3-Pin Small Outline Transistor, Body 2.92 x 1.3 mm, Pitch 0.95 mm; ComponentLink3Description: Package Specification; ComponentLink1Description: Manufacturer URL; Packing: Tape and Reel; PackageVersion: Rev. AP, 11/2009; Mounting Technology: Surface Mount; ComponentLink2URL: http://www.onsemi.cn/pub_link/Collateral/MMBTA42LT1-D.PDF
R7 = 0603_1K: Power: W
R8 = 0603_10K: Power: W; Package: 0603
R9 = 0603_220R: Power: W
U4 = LTV-352T: as U3 on sheet 3xInputs; RefDes: RefDes; Type: Type; Supplier 1: Rs; Manufacturer Part Number: LTV-352T; RoHS: Yes; Category: Optocouplers; Stock 1: 22730; Pricing 1: 25=0,29, 50=0,278, 250=0,228, 500=0,2 (GBP); ComponentLink1URL: https://datasheet.ciiva.com/11772/0900766b80de6aef-11772096.pdf?src-supplier=Rs; ComponentLink1Description: https://datasheet.ciiva.com/11772/0900766b80de6aef-11772096.pdf?src-supplier=Rs; ComponentLink2URL: https://datasheet.ciiva.com/2086/ltv-352t-2086258.pdf?src-supplier=Digikey; ComponentLink2Description: https://datasheet.ciiva.com/2086/ltv-352t-2086258.pdf?src-supplier=Digikey; ComponentLink3URL: https://datasheet.ciiva.com/19471/1260710-19471302.pdf?src-supplier=Jameco; ComponentLink3Description: https://datasheet.ciiva.com/19471/1260710-19471302.pdf?src-supplier=Jameco; ComponentLink4URL: https://datasheet.ciiva.com/15118/getdatasheetpartid-145582-15118811.pdf?src-supplier=Verical; ComponentLink4Description: https://datasheet.ciiva.com/15118/getdatasheetpartid-145582-15118811.pdf?src-supplier=Verical; ComponentLink5URL: https://datasheet.ciiva.com/2086/s-110-ltv-352t20140520-2086259.pdf?src-supplier=Digikey; ComponentLink5Description: https://datasheet.ciiva.com/2086/s-110-ltv-352t20140520-2086259.pdf?src-supplier=Digikey; ComponentLink6URL: https://datasheet.ciiva.com/2086/s-110-ltv-352t20140520-2086260.pdf?src-supplier=Digikey; ComponentLink6Description: https://datasheet.ciiva.com/2086/s-110-ltv-352t20140520-2086260.pdf?src-supplier=Digikey; Supplier Part Number 1: 6912063P

## Nets that join several sheets
+3V3: MCU (17 pins), Power (C1.1 C4.1 D6.2 U1.6), U_3xInputs0 (R5A.2), U_3xInputs1 (R5B.2), U_3xInputs2 (R5C.2), canbus (C23.2 U5.3), U_3xOuts0 (Q2A.3), U_3xOuts1 (Q2B.3), U_3xOuts2 (Q2C.3)
GND: MCU (20 pins), Power (C4.2 C7.2 R12.1 U1.7), U_3xInputs0 (C19A.1 U3A.3), U_3xInputs1 (C19B.1 U3B.3), U_3xInputs2 (C19C.1 U3C.3), canbus (5 pins), U_3xOuts0 (U4A.2), U_3xOuts1 (U4B.2), U_3xOuts2 (U4C.2)
GND_E: main (J1.2 J1.3 P3.4 P4.4), Power (C2.2 C6.2 FL2D-13-471R3.2 SW1.3), U_3xInputs0 (U3A.2), U_3xInputs1 (U3B.2), U_3xInputs2 (U3C.2), U_3xOuts0 (C20A.1 R7A.2 U4A.3), U_3xOuts1 (C20B.1 R7B.2 U4B.3), U_3xOuts2 (C20C.1 R7C.2 U4C.3)
Vin: main (J1.1 P3.5 P4.5), Power (F1.1 R1.2), U_3xOuts0 (Q1A.3 R8A.2), U_3xOuts1 (Q1B.3 R8B.2), U_3xOuts2 (Q1C.3 R8C.2)
INPUT: main (P4.2), U_3xInputs1 (D3B.2)
INPUT: main (P4.1), U_3xInputs0 (D3A.2)
INPUT: main (P4.3), U_3xInputs2 (D3C.2)
NetD5_1: main (P2.7), canbus (D5.1 L1.3 R10.2)
NetD5_2: main (P2.2), canbus (D5.2 L1.2 R11.1)
OUTPUT: main (P3.2), U_3xOuts1 (C20B.2 Q1B.1 R8B.1 U4B.4)
OUTPUT: main (P3.1), U_3xOuts0 (C20A.2 Q1A.1 R8A.1 U4A.4)
OUTPUT: main (P3.3), U_3xOuts2 (C20C.2 Q1C.1 R8C.1 U4C.4)
uc_CAN_Rx: MCU (U2.32), canbus (C22.2 U5.4)
uc_CAN_Tx: MCU (U2.33), canbus (U5.1)